# EAGLE design power_card_24_rev2 (EAGLE 9.6.2)
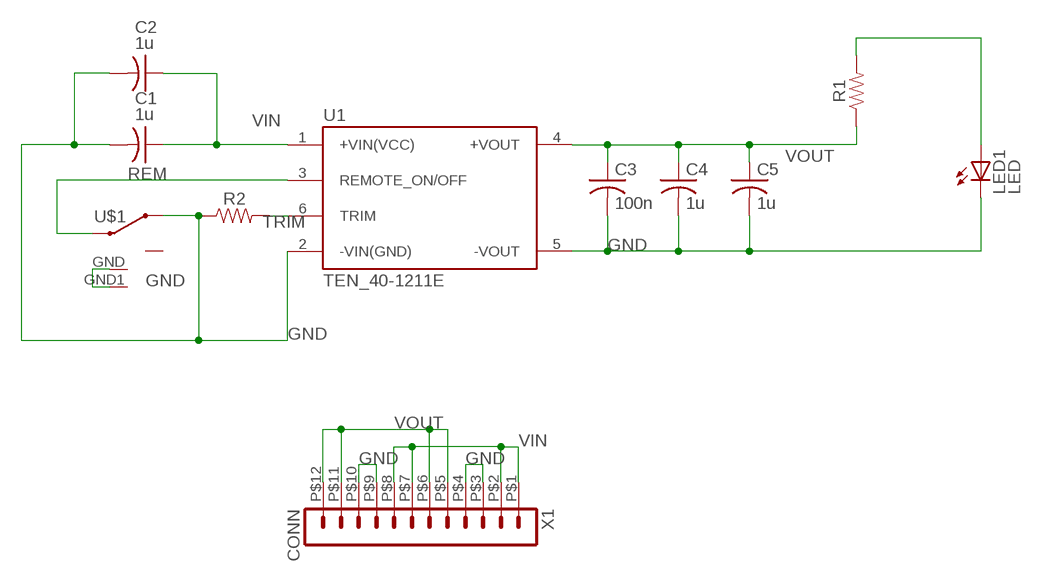
[diagram p0: schematic, sheet 1]

## Parts
C1  1u  C-USC1206  [C1206]
C2  1u  C-USC1206  [C1206]
C3  100n  C-USC1206  [C1206]
C4  1u  C-USC1206  [C1206]
C5  1u  C-USC1206  [C1206]
LED1  LED  LED5MM  [LED5MM]
R1  RESISTOR1206  [1206]
R2  RESISTOR1206  [1206]
U1  TEN_40-1211E  [CONV_TEN_40-1211E]
U$1  1825232-1  [1825232-1]
X1  CONN  HEADER_POS12_44764-1201  [44764-1201]

## Nets
GND: C1.2 C2.2 C3.2 C4.2 C5.2 LED1.K(C) R2.1 U1.2(-VIN(GND)) U1.5(-VOUT) U$1.3 U$1.GND U$1.GND1 X1.P$3 X1.P$4 X1.P$9 X1.P$10
N$2: LED1.A R1.2
REM: U1.3(REMOTE_ON/OFF) U$1.2
TRIM: R2.2 U1.6(TRIM)
VIN: C1.1 C2.1 U1.1(+VIN(VCC)) X1.P$1 X1.P$2 X1.P$7 X1.P$8
VOUT: C3.1 C4.1 C5.1 R1.1 U1.4(+VOUT) X1.P$5 X1.P$6 X1.P$11 X1.P$12
Unconnected: U$1.1

## Library data of the parts
C1-C5 = adafruit:C-US: CAPACITOR, American symbol
LED1 = adafruit:LED: LED OSRAM: - CHIPLED LG R971, LG N971, LY N971, LG Q971, LY Q971, LO R971, LY R971 LH N974, LH R974 LS Q976, LO Q976, LY Q976 LO Q996 - Hyper CHIPLED LW Q18S LB Q993, LB Q99A, LB R99A - SideLED LS A670, LO A670, LY A670, LG A670, LP A670 LB A673, LV A673, LT A673, LW A673 LH A674 LY A675 LS A676, LA A676, LO A676, LY A676, LW A676 LS A679, LY A679, LG A679 - Hyper Micro SIDELED® LS Y876, LA Y876, LO Y876, LY Y876 LT Y87S - SmartLED LW L88C, LW L88S LB L89C, LB L89S, LG L890 LS L89K, LO L89K, LY L89K LS L896, LA L896, LO L896, LY L896 - TOPLED LS T670, LO T670, LY T670, LG T670, LP T670 LSG T670, LSP T670, LSY T670, LOP T670, LYG T670 LG T671, LOG T671, LSG T671 LB T673, LV T673, LT T673, LW T673 LH T674 LS T676, LA T676, LO T676, LY T676, LB T676, LH T676, LSB T676, LW T676 LB T67C, LV T67C, LT T67C, LS T67K, LO T67K, LY T67K, LW E67C LS E67B, LA E67B, LO E67B, LY E67B, LB E67C, LV E67C, LT E67C LW T67C LS T679, LY T679, LG T679 LS T770, LO T770, LY T770, LG T770, LP T770 LB T773, LV T773, LT T773, LW T773 LH T774 LS E675, LA E675, LY E675, LS T675 LS T776, LA T776, LO T776, LY T776, LB T776 LHGB T686 LT T68C, LB T68C - Hyper Mini TOPLED® LB M676 - Mini TOPLED Santana® LG M470 LS M47K, LO M47K, LY M47K Source: http://www.osram.convergy.de/
R1 R2 = SparkFun-Resistors:RESISTOR: Generic Resistor Package
U1 = Traco_Boardx:TEN_40-1211E: Check availability <https://pricing.snapeda.com/parts/TEN%2040-1211E/Traco%20Power/view-part?ref=eda>; AVAILABILITY: In Stock; DESCRIPTION: 40 Watt DC/DC converter, industrial, 2:1 input, cost/quality efficient, 2x1; MF: Traco Power; MP: TEN 40-1211E; PACKAGE: 2&quot; X 1&quot; Traco Power; PRICE: None; PURCHASE-URL: https://pricing.snapeda.com/search/part/TEN 40-1211E/?ref=eda
U$1 = SWITCH_RIGHT_ANGLE:1825232-1; AVAILABILITY: Unavailable; COMMENT: 1825232-1; DESCRIPTION: Switch Slide ON None ON SPDT Side Slide 0.2A 30VDC 10000Cycle PC Pins Bracket Mount/Through Hole; EU_ROHS_COMPLIANCE: Compliant; MF: TE Connectivity; MP: 1825232-1; PACKAGE: None; PRICE: None; TE_PURCHASE_URL: https://www.te.com/usa-en/product-1825232-1.html?te_bu=Cor&te_type=disp&te_campaign=seda_glo_cor-seda-global-disp-prtnr-fy19-seda-model-bom-cta_sma-317_1&elqCampaignId=32493
X1 = con-molex-micro-fit-3_0:HEADER_POS12_?: Molex - Micro-Fit 3.0 Series connector, 3.00mm (0.118") pitch header, 12 positions.

## Board
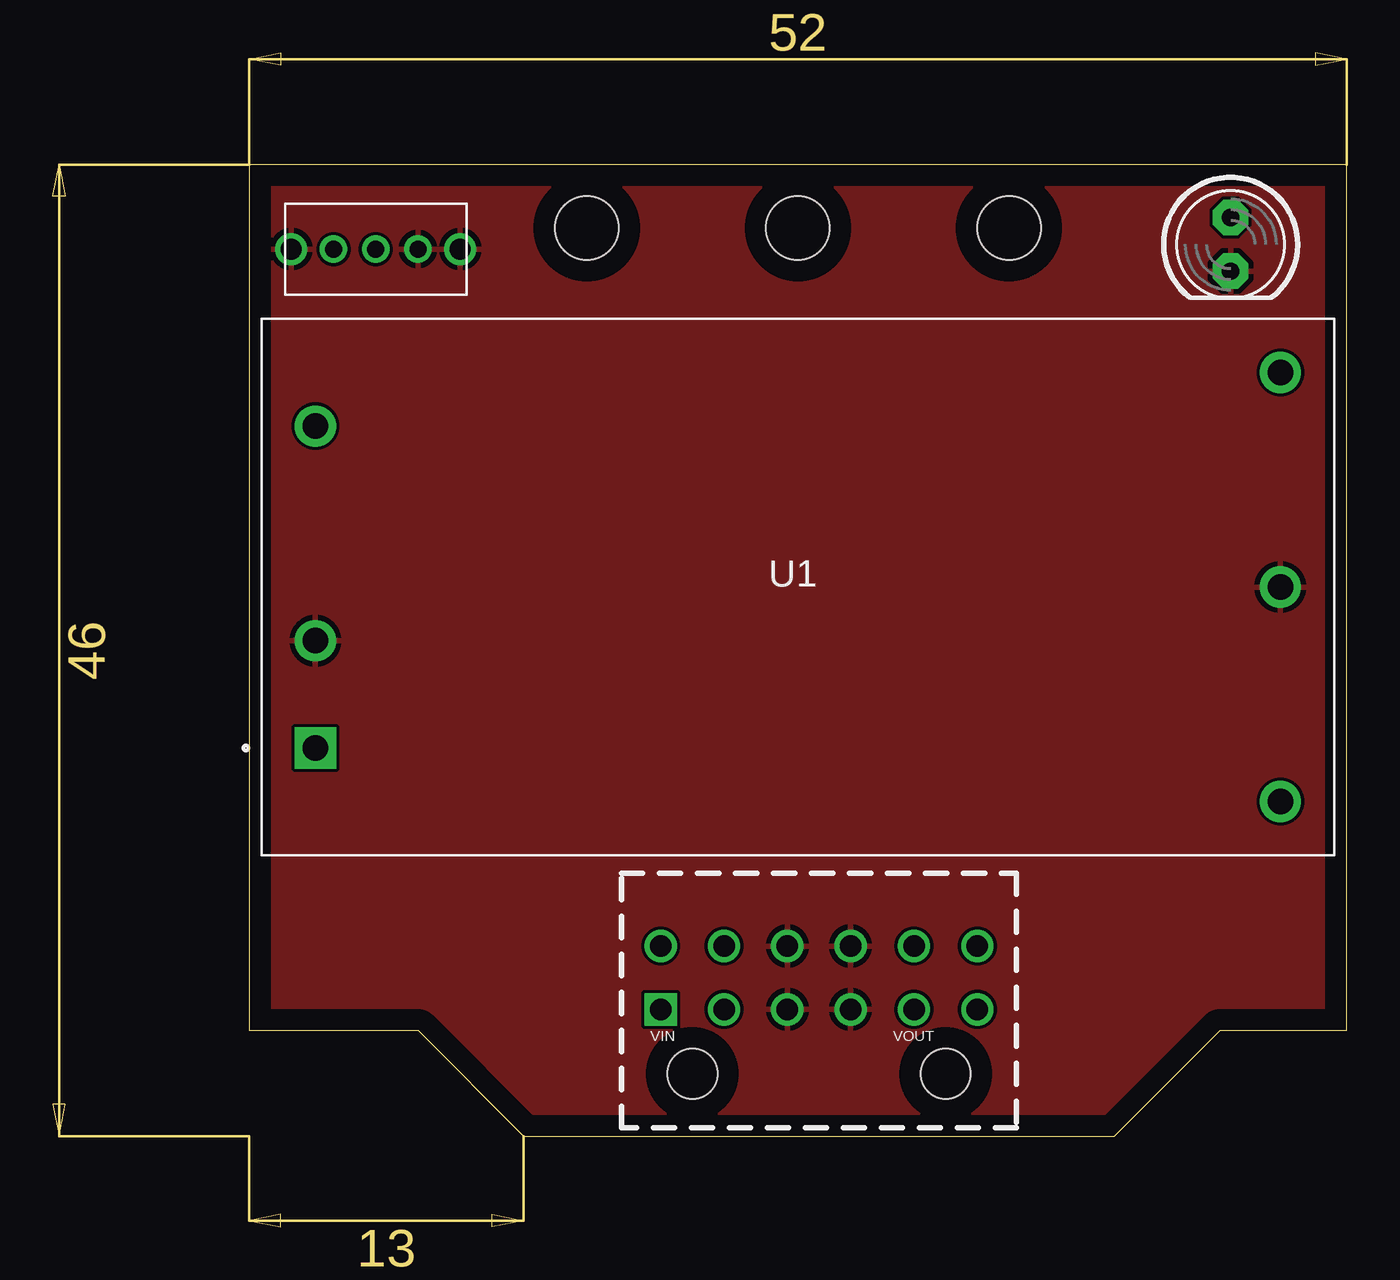
[diagram p1: board, top side]
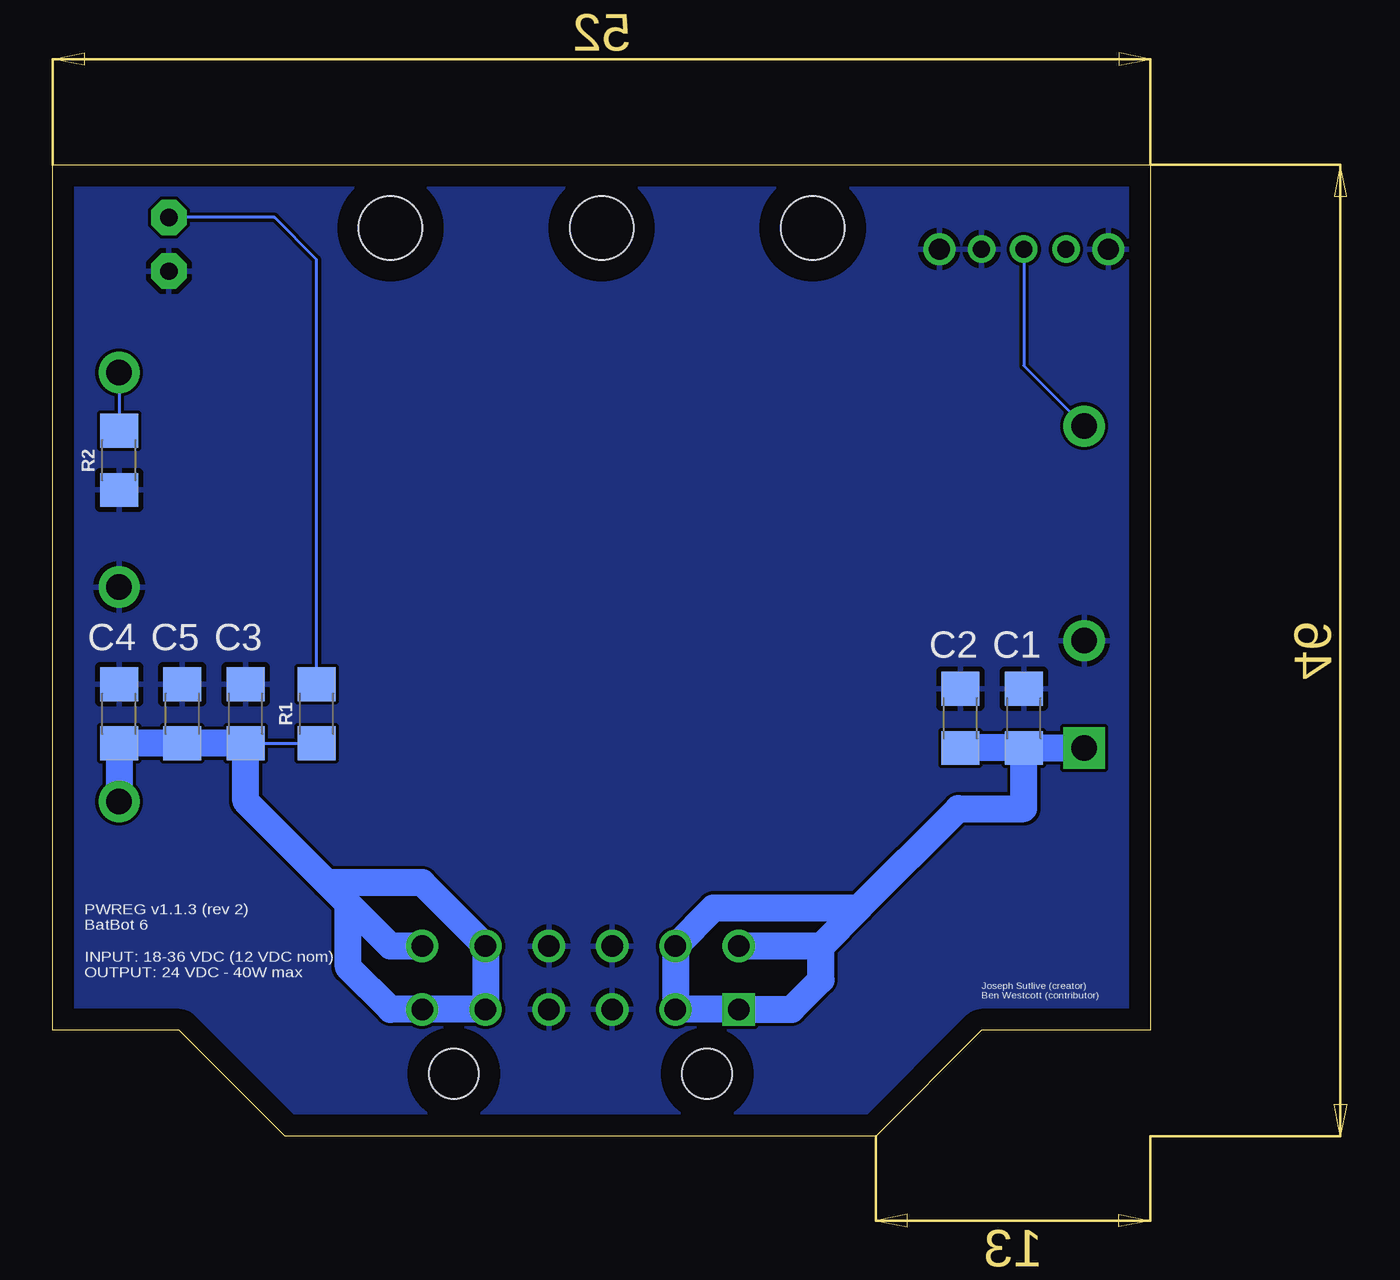
[diagram p2: board, bottom side, seen from below]

Size 52 x 46 mm. Coordinates in mm from the lower left corner, seen from the top.
Outline: 0,5 8,5 13,0 41,0 46,5 52,5 52,46 0,46 0,5
Copper layers (1*16): Top 0.035mm / dielectric 1.5mm / Bottom 0.035mm
Design rules "default": minimum track width 6mil, minimum drill 0.35mm, track to track 6mil, track to pad 6mil, pad to pad 6mil, via to via 6mil, smd to smd 6mil, copper to edge 40mil, drill to drill 6mil, minimum pad ring 10mil, minimum via ring 8mil, stop-mask expansion 4mil, vias tented up to drill 0mil, thermal gap 10mil
Holes 3 mm at 16,43 36,43 26,43

### Footprints (pad centres in the part's own frame; a part is rotated, then mirrored left to right if it is on the bottom)
C1206 = smd 1.6 x 1.8: 1 -1.4,0; 2 1.4,0
LED5MM = drill 0.813 pad 1.676 octagon: A -1.27,0; K 1.27,0
1206 = smd 1.6 x 1.8: 1 -1.4,0; 2 1.4,0
CONV_TEN_40-1211E = drill 1.2 pad 1.95 square: 1 22.86,7.62 | drill 1.2 pad 1.95: 2 22.86,2.54; 3 22.86,-7.62; 4 -22.86,10.16; 5 -22.86,0; 6 -22.86,-10.16
1825232-1 = drill 0.8: 1 -2,0; 2 0,0; 3 2,0 | drill 1: GND -4,0; GND1 4,0
44764-1201 = drill 1.02 square: P$1 -7.5,0 | drill 1.02: P$2 -4.5,0; P$3 -1.5,0; P$4 1.5,0; P$5 4.5,0; P$6 7.5,0; P$7 -7.5,3; P$8 -4.5,3; P$9 -1.5,3; P$10 1.5,3; P$11 4.5,3; P$12 7.5,3 | hole 2.36: -6,-3.05; 6,-3.05

### Placement (x,y rotation side)
C1  6,19.78 90 bottom
C2  9,19.78 90 bottom
C3  42.86,20 90 bottom
C4  48.86,20 90 bottom
C5  45.86,20 90 bottom
LED1  46.5,42.23 270 top
R1  39.5,20 90 bottom
R2  48.86,32 90 bottom
U1  26,26 180 top
U$1  6,42 0 top
X1  27,6 0 top

### Tracks (layer width: path | path; a pad name or v marks a point on that pad's centre or on a via)
GND
  pour Top: 0,46 0,5 8,5 13,0 41,0 46,5 52,5 52,46
  pour Bottom: 0,46 52,46 52,5 46,5 41,0 13,0 8,5 0,5
N$2
  Bottom 0.152: R1.2 39.5,41.5 41.5,43.5 LED1.A
REM
  Bottom 0.152: U$1.2 6,36.48 4.51,34.99 U1.3
TRIM
  Bottom 0.152: U1.6 R2.2
VIN
  Bottom 1.27: 15.6,9 13.8,10.8 | 15.6,9 X1.P$7 | 15.6,9 15.6,7.4 17,6 X1.P$1 X1.P$2 X1.P$8 20.7,10.8 13.8,10.8 | 13.8,10.8 9.1,15.5 6,15.5 C1.1 | C1.1 U1.1 | C1.1 C2.1
VOUT
  Bottom 0.152: C3.1 R1.1
  Bottom 1.27: X1.P$12 36,9 38,11 | 38,11 39,12 | 38,11 38,8 36,6 X1.P$6 X1.P$5 X1.P$11 34.5,12 39,12 | 39,12 42.86,15.86 C3.1 C5.1 C4.1 U1.4

### Text on the board
bPlace: Joseph Sutlive (creator) / Ben Westcott (contributor) | PWREG v1.1.3 (rev 2) / BatBot 6 / / INPUT: 18-36 VDC (12 VDC nom) / OUTPUT: 24 VDC - 40W max
tNames: VIN | VOUT